# Altium schematic sheet h_bridge.SchDoc
size A4; Organization: Altium Limited; Address1: L3, 12a Rodborough Rd; Address2: Frenchs Forest; Address3: NSW; Address4: Australia 2086
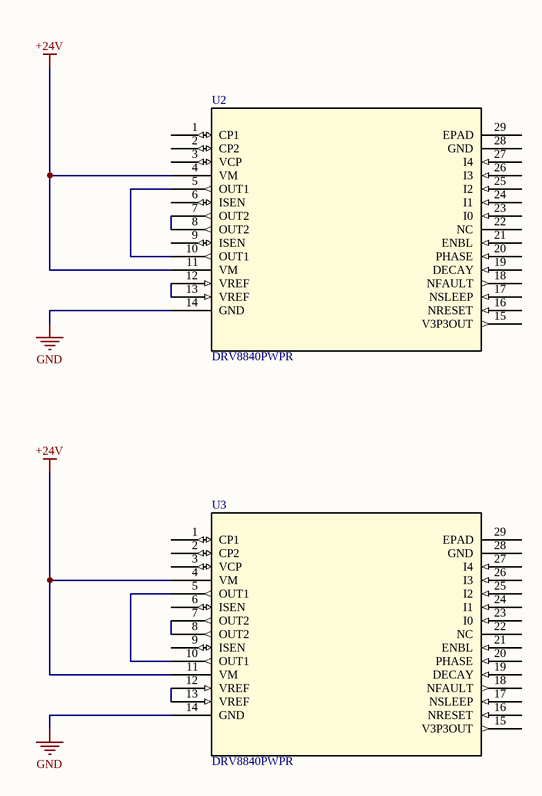
[diagram p0: h_bridge.SchDoc]

## Parts
U2  DRV8840PWPR  [PWP28_5P18X3P1]
U3  DRV8840PWPR  [PWP28_5P18X3P1]

## Nets
+24V: U2.4(VM) U2.11(VM) U3.4(VM) U3.11(VM)
GND: U2.14(GND) U3.14(GND)
NetU2_5: U2.5(OUT1) U2.10(OUT1)
NetU2_7: U2.7(OUT2) U2.8(OUT2)
NetU2_12: U2.12(VREF) U2.13(VREF)
NetU3_5: U3.5(OUT1) U3.10(OUT1)
NetU3_7: U3.7(OUT2) U3.8(OUT2)
NetU3_12: U3.12(VREF) U3.13(VREF)

Not connected (* = marked no-connect by the designer): U2 1(CP1) 2(CP2) 3(VCP) 6(ISEN) 9(ISEN) 15(V3P3OUT) 16(NRESET) 17(NSLEEP) 18(NFAULT) 19(DECAY) 20(PHASE) 21(ENBL) 22(NC) 23(I0) 24(I1) 25(I2) 26(I3) 27(I4) 28(GND) 29(EPAD); U3 1(CP1) 2(CP2) 3(VCP) 6(ISEN) 9(ISEN) 15(V3P3OUT) 16(NRESET) 17(NSLEEP) 18(NFAULT) 19(DECAY) 20(PHASE) 21(ENBL) 22(NC) 23(I0) 24(I1) 25(I2) 26(I3) 27(I4) 28(GND) 29(EPAD)

## Notes on the sheet
- Title
- Size:
- Date:
- A4
- Number:
- Time:
- Revision:
- Sheet
- of
- File:

## Library data of the parts
U2 U3 = DRV8840PWPR: Imported; Manufacturer: Texas Instruments; Built_By: EMA_UL_Team; C: Copyright (C) 2015 Accelerated Designs. All rights reserved; Vendor: Texas Instruments; Manufacturer_Part_Number: DRV8840PWPR; RefDes: RefDes; Type: DEV; Value: Value